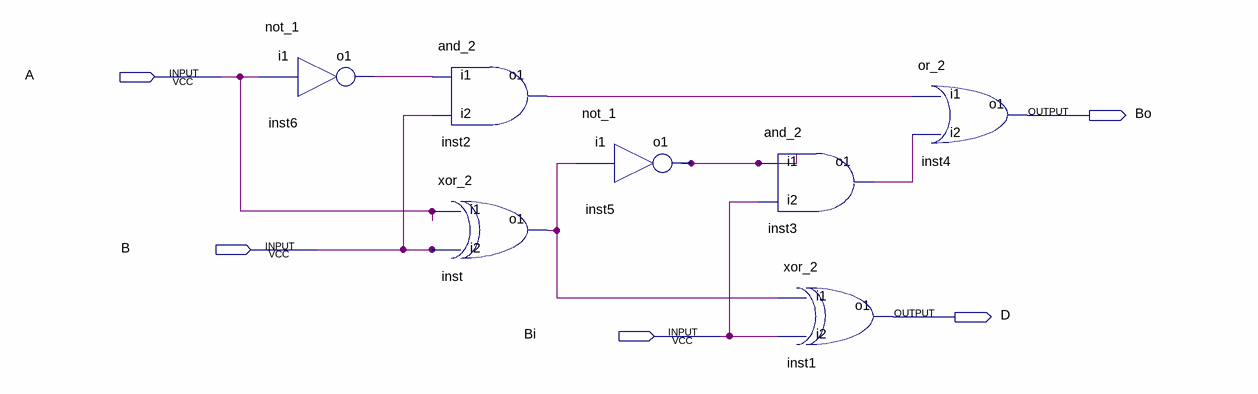
[diagram p0: schematic sheet]
// Quartus schematic FS.bdf as structural Verilog: 7 symbols, 5 pins
module FS (
  input  A,
  input  B,
  input  Bi,
  output Bo,
  output D
);

  wire inst2_o1, inst3_o1, inst5_o1, inst6_o1, inst_o1;

  not_1 inst6 (.i1(A), .o1(inst6_o1));
  and_2 inst2 (.i1(inst6_o1), .i2(B), .o1(inst2_o1));
  xor_2 inst (.i1(A), .i2(B), .o1(inst_o1));
  not_1 inst5 (.i1(inst_o1), .o1(inst5_o1));
  and_2 inst3 (.i1(inst5_o1), .i2(Bi), .o1(inst3_o1));
  xor_2 inst1 (.i1(inst_o1), .i2(Bi), .o1(D));
  or_2 inst4 (.i1(inst2_o1), .i2(inst3_o1), .o1(Bo));
endmodule
